# Altium schematic sheet USB PROGRAMMER.SCHDOC
size A4
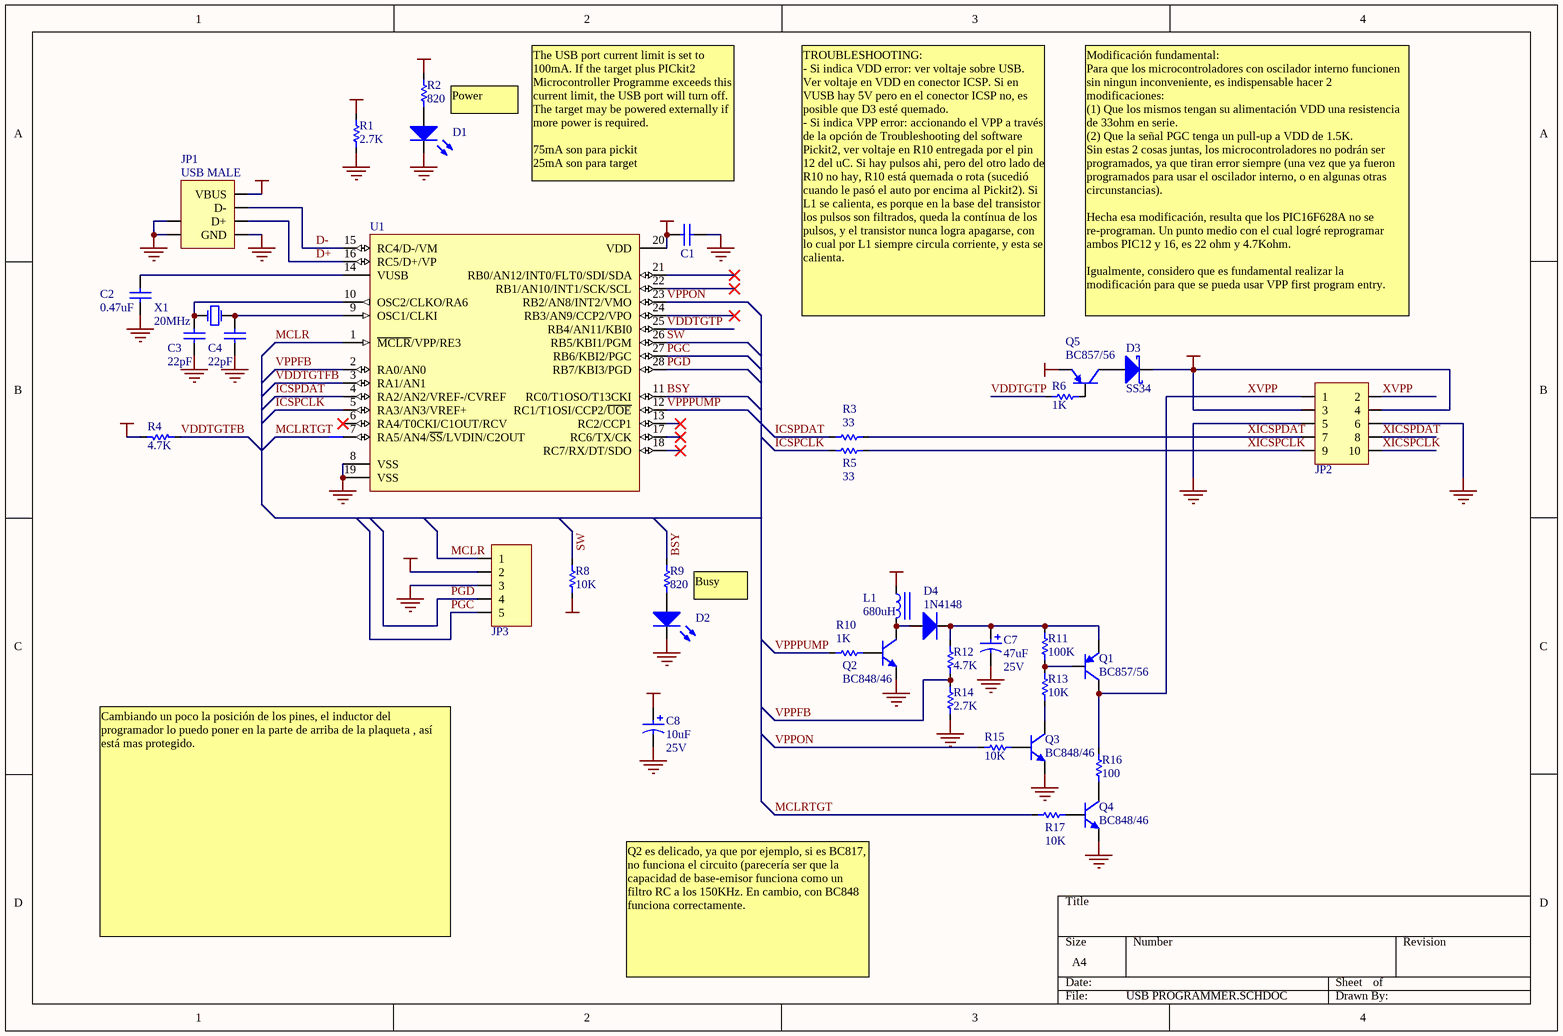
[diagram p0: USB PROGRAMMER.SCHDOC]

## Parts
C1  Cap  [1206NP]  (value not drawn)
C2  value 0.47uF  [1206NP]  (hidden comment: Cap)
C3  value 22pF  [1206NP]  (hidden comment: Cap)
C4  value 22pF  [1206NP]  (hidden comment: Cap)
C7  value 47uF  Voltaje: 25V  [cap4mm]  (hidden comment: Cap Pol)
C8  value 10uF  Voltaje: 25V  [cap4mm]  (hidden comment: Cap Pol)
D1  LED  [LED3mm]  (value not drawn)
D2  LED  [LED3mm]  (value not drawn)
D3  SS34  [diode600]
D4  1N4148  [DSMD1MM]
JP1  USB MALE  [USB_A_MALE]
JP2  Header5x1  [IDC5x2_90]  (value not drawn)
JP3  Header5x1  [HDR5x1]  (value not drawn)
L1  value 680uH  [RES400TH]
Q1  BC857/56  [SOT23]
Q2  BC848/46  [SOT23]
Q3  BC848/46  [SOT23]
Q4  BC848/46  [SOT23]
Q5  BC857/56  [SOT23]
R1  value 2.7K  [1206NP]  (hidden comment: Res)
R2  value 820  [1206NP]  (hidden comment: Res)
R3  value 33  [1206NP]  (hidden comment: Res)
R4  value 4.7K  [1206NP]  (hidden comment: Res)
R5  value 33  [1206NP]  (hidden comment: Res)
R6  value 1K  [res250th_vertical]  (hidden comment: Res)
R8  value 10K  [1206NP]  (hidden comment: Res)
R9  value 820  [1206NP]  (hidden comment: Res)
R10  value 1K  [1206NP]  (hidden comment: Res)
R11  value 100K  [1206NP]  (hidden comment: Res)
R12  value 4.7K  [1206NP]  (hidden comment: Res)
R13  value 10K  [1206NP]  (hidden comment: Res)
R14  value 2.7K  [1206NP]  (hidden comment: Res)
R15  value 10K  [1206NP]  (hidden comment: Res)
R16  value 100  [1206NP]  (hidden comment: Res)
R17  value 10K  [RES250TH]  (hidden comment: Res)
U1  (no value)  [soic28]
W1  CABLE  [1206NP]  (value not drawn)
X1  value 20MHz  [XTAL1]  (hidden comment: XTAL)

## Nets
GND: C1.1 C2.1 C3.1 C4.2 C7.2 C8.2 D1.2(K) D2.2(K) JP1.4(GND) JP1.5 JP1.6 JP2.5 JP2.6 JP3.3 Q2.3(E) Q3.3(E) Q4.3(E) R1.2 R14.1 U1.8(VSS) U1.19(VSS)
VCC: C1.2 C8.1 JP1.1(VBUS) JP3.2 L1.1 Q5.3(E) R1.1 R2.2 R8.2 U1.20(VDD)
VDDTGT: D3.2(K) JP2.3 JP2.4 R4.2
BSY: R9.2 U1.11(RC0/T1OSO/T13CKI)
D+: JP1.3(D+) U1.16(RC5/D+/VP)
D-: JP1.2(D-) U1.15(RC4/D-/VM)
ICSPCLK: R5.1 U1.5(RA3/AN3/VREF+)
ICSPDAT: R3.1 U1.4(RA2/AN2/VREF-/CVREF)
MCLR: JP3.1 U1.1(~{MCLR}/VPP/RE3)
MCLRTGT: R17.2 W1.2
PGC: JP3.5 U1.27(RB6/KBI2/PGC)
PGD: JP3.4 U1.28(RB7/KBI3/PGD)
SW: R8.1 U1.26(RB5/KBI1/PGM)
VDDTGTFB: R4.1 U1.3(RA1/AN1)
VDDTGTP: R6.2 U1.25(RB4/AN11/KBI0)
VPPFB: R12.1 R14.2 U1.2(RA0/AN0)
VPPON: R15.2 U1.23(RB2/AN8/INT2/VMO)
VPPPUMP: R10.2 U1.12(RC1/T1OSI/CCP2/~{UOE})
XICSPCLK: JP2.9 JP2.10 R5.2
XICSPDAT: JP2.7 JP2.8 R3.2
XVPP: JP2.1 JP2.2 Q1.1(C) R16.2
NetC2_2: C2.2 U1.14(VUSB)
NetC3_2: C3.2 U1.10(OSC2/CLKO/RA6) X1.1(OSC1)
NetC4_1: C4.1 U1.9(OSC1/CLKI) X1.2(OSC2)
NetC7_1: C7.1 D4.2 Q1.3(E) R11.2 R12.2
NetD1_1: D1.1(A) R2.1
NetD2_1: D2.1(A) R9.1
NetD3_1: D3.1(A) Q5.1(C)
NetD4_1: D4.1 L1.2 Q2.1(C)
NetQ1_2: Q1.2(B) R11.1 R13.2
NetQ2_2: Q2.2(B) R10.1
NetQ3_1: Q3.1(C) R13.1
NetQ3_2: Q3.2(B) R15.1
NetQ4_1: Q4.1(C) R16.1
NetQ4_2: Q4.2(B) R17.1
NetQ5_2: Q5.2(B) R6.1
NetU1_7: U1.7(RA5/AN4/~{SS}/LVDIN/C2OUT) W1.1

Not connected (* = marked no-connect by the designer): U1 6(RA4/T0CKI/C1OUT/RCV)* 13(RC2/CCP1)* 17(RC6/TX/CK)* 18(RC7/RX/DT/SDO)* 21(RB0/AN12/INT0/FLT0/SDI/SDA)* 22(RB1/AN10/INT1/SCK/SCL)* 24(RB3/AN9/CCP2/VPO)*

## Notes on the sheet
- Power
- The USB port current limit is set to 100mA. If the target plus PICkit2 Microcontroller Programme exceeds this current limit, the USB port will turn off. The target may be powered externally if more power is required.
  75mA son para pickit
  25mA son para target
- TROUBLESHOOTING:
  - Si indica VDD error: ver voltaje sobre USB. Ver voltaje en VDD en conector ICSP. Si en VUSB hay 5V pero en el conector ICSP no, es posible que D3 esté quemado.
  - Si indica VPP error: accionando el VPP a través de la opción de Troubleshooting del software Pickit2, ver voltaje en R10 entregada por el pin 12 del uC. Si hay pulsos ahi, pero del otro lado de R10 no hay, R10 está quemada o rota (sucedió cuando le pasó el auto por encima al Pickit2). Si L1 se calienta, es porque en la base del transistor los pulsos son filtrados, queda la contínua de los pulsos, y el transistor nunca logra apagarse, con lo cual por L1 siempre circula corriente, y esta se calienta.
- Modificación fundamental:
  Para que los microcontroladores con oscilador interno funcionen sin ningun inconveniente, es indispensable hacer 2 modificaciones:
  (1) Que los mismos tengan su alimentación VDD una resistencia de 33ohm en serie.
  (2) Que la señal PGC tenga un pull-up a VDD de 1.5K.
  Sin estas 2 cosas juntas, los microcontroladores no podrán ser programados, ya que tiran error siempre (una vez que ya fueron programados para usar el oscilador interno, o en algunas otras circunstancias).
  Hecha esa modificación, resulta que los PIC16F628A no se re-programan. Un punto medio con el cual logré reprogramar ambos PIC12 y 16, es 22 ohm y 4.7Kohm.
  Igualmente, considero que es fundamental realizar la modificación para que se pueda usar VPP first program entry.
- Busy
- Cambiando un poco la posición de los pines, el inductor del programador lo puedo poner en la parte de arriba de la plaqueta , así está mas protegido.
- Q2 es delicado, ya que por ejemplo, si es BC817, no funciona el circuito (parecería ser que la capacidad de base-emisor funciona como un filtro RC a los 150KHz. En cambio, con BC848 funciona correctamente.

## Library data of the parts
C1 = Cap: Capacitor; Voltage: 50V; Value: 100nF; Price: 0.25; Technology: Ceramic
C2-C4 = Cap: Capacitor; Voltage: 50V; Price: 0.25; Technology: Ceramic
C7 C8 = Cap Pol: Capacitor Polarizado; Price: ?
D1 D2 = LED: Color: Green; Price: ?
D3 = 1N5822: Schottky Diode 3A 40V; Revision: July-2002: Re-released for DXP Platform.
D4 = 1N4148: High Conductance Fast Diode; Price: ?
JP1 = USB: USB Connector; Price: ?
JP2 = Header5x2: Header 5x2; Price: ?
JP3 = Header5x1: Header 5x1; Price: ?
L1 = Inductor: Revision: July-2002: Re-released for DXP Platform.
Q1 Q5 = BC856A: 100mA 65V PNP Bipolar Transistor; pin to pad: 1>3 2>1 3>2; Price: 0.3267
Q2-Q4 = BC846A: 100mA 65V NPN Bipolar Transistor; pin to pad: 1>3 2>1 3>2; Price: 0.38
R1-R6 R8-R17 = Res: Resistor; Power: 0.25W; Price: 0.036
U1 = PIC18F2550: Enhanced FLASH Microcontroller
X1 = XTAL: Crystal Oscillator; Price: ?